# EAGLE board ORAO2007 (EAGLE 9.6.2)
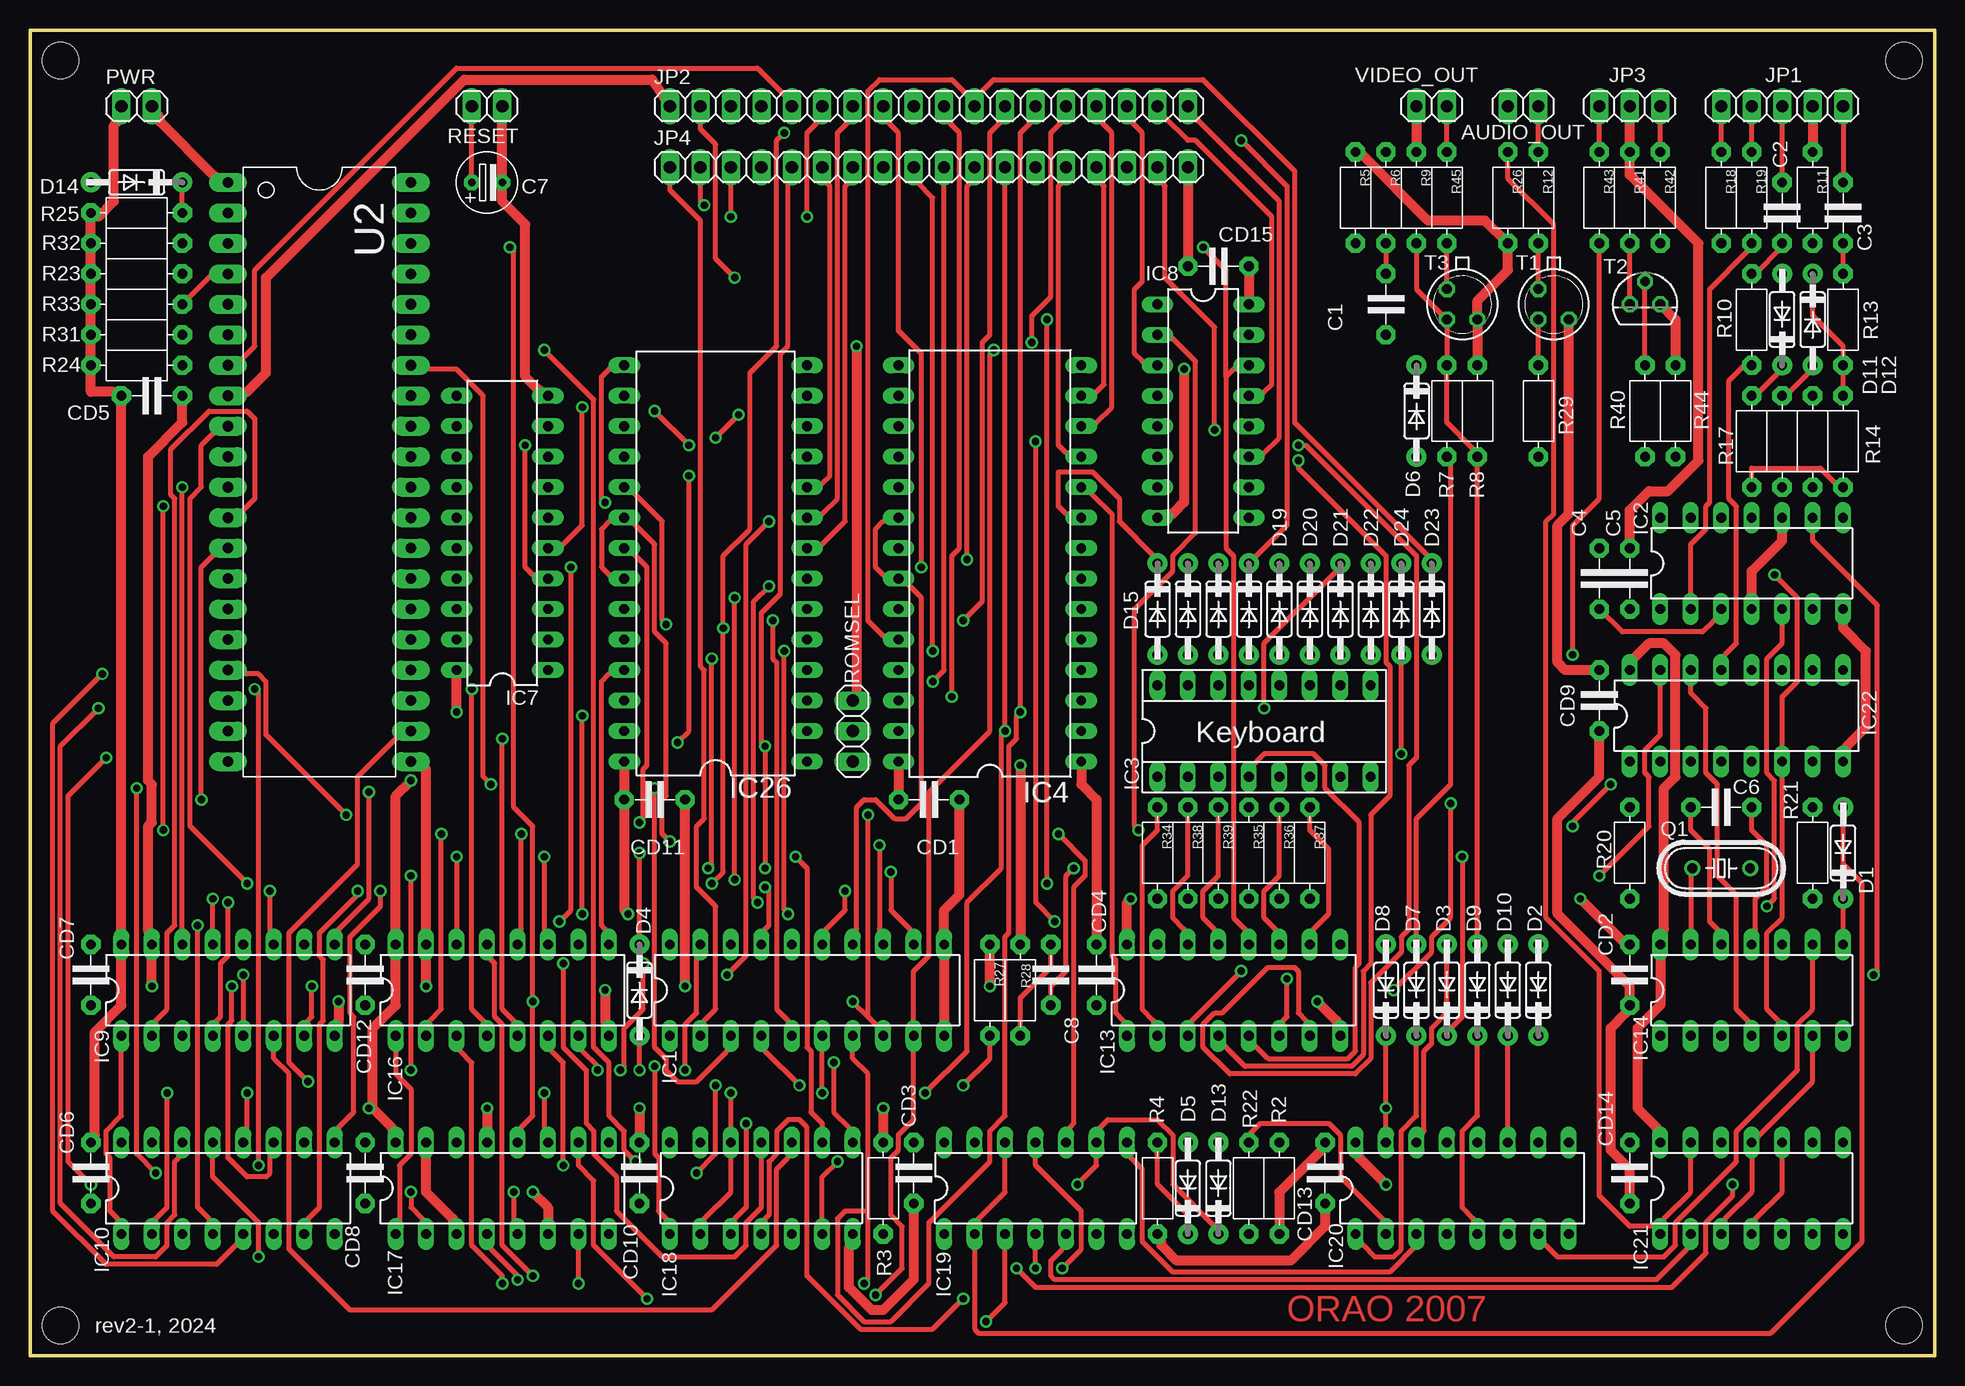
[diagram p1: board, top side]
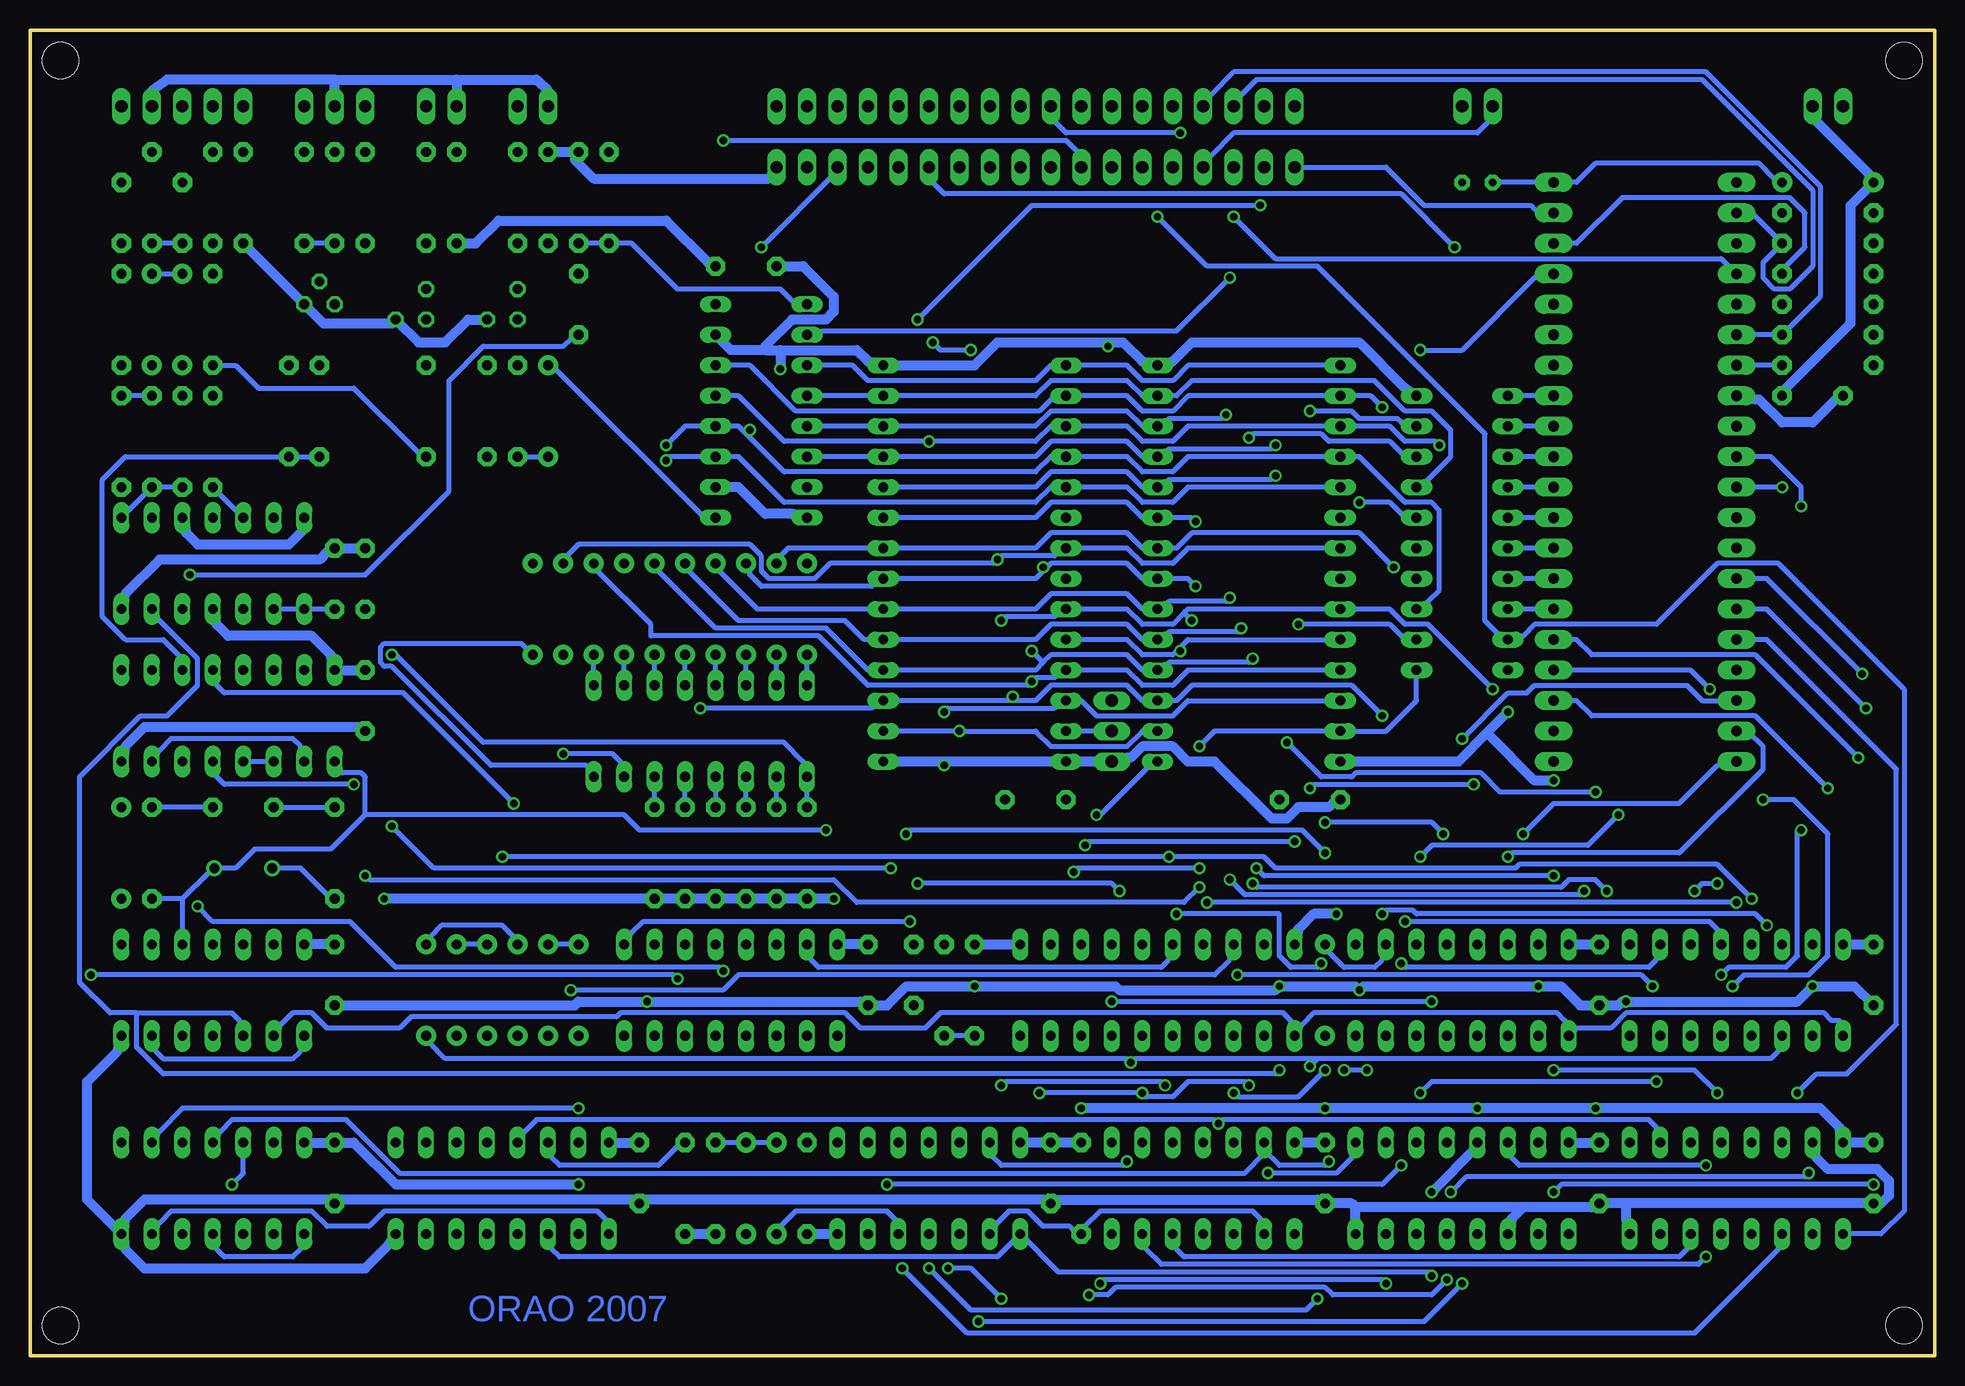
[diagram p2: board, bottom side, seen from below]

Size 158.75 x 110.49 mm. Coordinates in mm from the lower left corner, seen from the top.
Outline: 0,0 158.75,0 158.75,110.49 0,110.49 0,0
Copper layers (1*16): Top 0.035mm / dielectric 1.5mm / Bottom 0.035mm
Design rules "default": minimum track width 16mil, minimum drill 24mil, track to track 8mil, track to pad 8mil, pad to pad 8mil, via to via 8mil, smd to smd 8mil, copper to edge 40mil, drill to drill 8mil, minimum pad ring 10mil, minimum via ring 8mil, stop-mask expansion 4mil, vias tented up to drill 0mil, thermal gap 10mil
Net classes: 0 default: width 0.406 mm, clearance 0.203 mm; 1 gnd: width 0.813 mm, clearance 0.203 mm; 2 vcc: width 0.813 mm, clearance 0.203 mm
Holes 3.05 mm at 2.54,107.95 156.21,107.95 156.21,2.54 2.54,2.54

## Footprints (pad centres in the part's own frame; a part is rotated, then mirrored left to right if it is on the bottom)
1X02 = drill 1.016 long: 1 -1.27,0; 2 1.27,0
C-5 = drill 0.813 pad 1.6 octagon: 1 -2.54,0; 2 2.54,0
ES-2,5L = drill 0.61 pad 1.27 octagon: 1 0,0; 2 2.54,0
DO35-10 = drill 0.813 pad 1.676: A 3.81,0; C -3.81,0
DIL20 = drill 0.813 long: 1 -11.43,-3.81; 2 -8.89,-3.81; 3 -6.35,-3.81; 4 -3.81,-3.81; 5 -1.27,-3.81; 6 1.27,-3.81; 7 3.81,-3.81; 8 6.35,-3.81; 9 8.89,-3.81; 10 11.43,-3.81; 11 11.43,3.81; 12 8.89,3.81; 13 6.35,3.81; 14 3.81,3.81; 15 1.27,3.81; 16 -1.27,3.81; 17 -3.81,3.81; 18 -6.35,3.81; 19 -8.89,3.81; 20 -11.43,3.81
DIL14 = drill 0.813 long: 1 -7.62,-3.81; 2 -5.08,-3.81; 3 -2.54,-3.81; 4 0,-3.81; 5 2.54,-3.81; 6 5.08,-3.81; 7 7.62,-3.81; 8 7.62,3.81; 9 5.08,3.81; 10 2.54,3.81; 11 0,3.81; 12 -2.54,3.81; 13 -5.08,3.81; 14 -7.62,3.81
SOCKED-16 = drill 0.813 long: 1 -8.89,-3.81; 2 -6.35,-3.81; 3 -3.81,-3.81; 4 -1.27,-3.81; 5 1.27,-3.81; 6 3.81,-3.81; 7 6.35,-3.81; 8 8.89,-3.81; 9 8.89,3.81; 10 6.35,3.81; 11 3.81,3.81; 12 1.27,3.81; 13 -1.27,3.81; 14 -3.81,3.81; 15 -6.35,3.81; 16 -8.89,3.81
DIL28 = drill 0.813 long: 1 -16.51,-7.62; 2 -13.97,-7.62; 3 -11.43,-7.62; 4 -8.89,-7.62; 5 -6.35,-7.62; 6 -3.81,-7.62; 7 -1.27,-7.62; 8 1.27,-7.62; 9 3.81,-7.62; 10 6.35,-7.62; 11 8.89,-7.62; 12 11.43,-7.62; 13 13.97,-7.62; 14 16.51,-7.62; 15 16.51,7.62; 16 13.97,7.62; 17 11.43,7.62; 18 8.89,7.62; 19 6.35,7.62; 20 3.81,7.62; 21 1.27,7.62; 22 -1.27,7.62; 23 -3.81,7.62; 24 -6.35,7.62; 25 -8.89,7.62; 26 -11.43,7.62; 27 -13.97,7.62; 28 -16.51,7.62
DIL16 = drill 0.813 long: 1 -8.89,-3.81; 2 -6.35,-3.81; 3 -3.81,-3.81; 4 -1.27,-3.81; 5 1.27,-3.81; 6 3.81,-3.81; 7 6.35,-3.81; 8 8.89,-3.81; 9 8.89,3.81; 10 6.35,3.81; 11 3.81,3.81; 12 1.27,3.81; 13 -1.27,3.81; 14 -3.81,3.81; 15 -6.35,3.81; 16 -8.89,3.81
DIL28-6 = drill 0.813 long: 1 -16.51,-7.62; 2 -13.97,-7.62; 3 -11.43,-7.62; 4 -8.89,-7.62; 5 -6.35,-7.62; 6 -3.81,-7.62; 7 -1.27,-7.62; 8 1.27,-7.62; 9 3.81,-7.62; 10 6.35,-7.62; 11 8.89,-7.62; 12 11.43,-7.62; 13 13.97,-7.62; 14 16.51,-7.62; 15 16.51,7.62; 16 13.97,7.62; 17 11.43,7.62; 18 8.89,7.62; 19 6.35,7.62; 20 3.81,7.62; 21 1.27,7.62; 22 -1.27,7.62; 23 -3.81,7.62; 24 -6.35,7.62; 25 -8.89,7.62; 26 -11.43,7.62; 27 -13.97,7.62; 28 -16.51,7.62
1X05 = drill 1.016 long: 1 -5.08,0; 2 -2.54,0; 3 0,0; 4 2.54,0; 5 5.08,0
1X18 = drill 1.016 long: 1 -21.59,0; 2 -19.05,0; 3 -16.51,0; 4 -13.97,0; 5 -11.43,0; 6 -8.89,0; 7 -6.35,0; 8 -3.81,0; 9 -1.27,0; 10 1.27,0; 11 3.81,0; 12 6.35,0; 13 8.89,0; 14 11.43,0; 15 13.97,0; 16 16.51,0; 17 19.05,0; 18 21.59,0
1X03 = drill 1.016 long: 1 -2.54,0; 2 0,0; 3 2.54,0
HC49/S = drill 0.813: 1 -2.413,0; 2 2.413,0
R-7,5 = drill 0.813 pad 1.6 octagon: 1 -3.81,0; 2 3.81,0
TO18 = drill 0.813 octagon: 1 -1.27,-1.27; 2 1.27,-1.27; 3 1.27,1.27
TO92 = drill 0.813 octagon: 1 1.27,0; 2 0,1.905; 3 -1.27,0
DIP-40 = drill 0.889 pad 1.6 long: 1 -22.86,-7.62; 2 -20.32,-7.62; 3 -17.78,-7.62; 4 -15.24,-7.62; 5 -12.7,-7.62; 6 -10.16,-7.62; 7 -7.62,-7.62; 8 -5.08,-7.62; 9 -2.54,-7.62; 10 0,-7.62; 11 2.54,-7.62; 12 5.08,-7.62; 13 7.62,-7.62; 14 10.16,-7.62; 15 12.7,-7.62; 16 15.24,-7.62; 17 17.78,-7.62; 18 20.32,-7.62; 19 22.86,-7.62; 20 25.4,-7.62; 21 25.4,7.62; 22 22.86,7.62; 23 20.32,7.62; 24 17.78,7.62; 25 15.24,7.62; 26 12.7,7.62; 27 10.16,7.62; 28 7.62,7.62; 29 5.08,7.62; 30 2.54,7.62; 31 0,7.62; 32 -2.54,7.62; 33 -5.08,7.62; 34 -7.62,7.62; 35 -10.16,7.62; 36 -12.7,7.62; 37 -15.24,7.62; 38 -17.78,7.62; 39 -20.32,7.62; 40 -22.86,7.62

## Placement (x,y rotation side)
AUDIO_OUT  [1X02]  124.46,104.14 180 top
C1  100p  [C-5]  113.03,87.63 90 top
C2  [C-5]  146.05,95.25 270 top
C3  100n  [C-5]  151.13,95.25 90 top
C4  22n  [C-5]  130.81,64.77 90 top
C5  10n  [C-5]  133.35,64.77 90 top
C6  1n  [C-5]  140.97,45.72 0 top
C7  10u  [ES-2,5L]  36.83,97.79 0 top
C8  100p  [C-5]  85.09,31.75 270 top
CD1  100n  [C-5]  74.93,46.35 180 top
CD2  100n  [C-5]  133.35,31.75 90 top
CD3  100n  [C-5]  73.66,15.24 90 top
CD4  100n  [C-5]  88.9,31.75 90 top
CD5  100n  [C-5]  10.16,80.01 180 top
CD6  100n  [C-5]  5.08,15.24 90 top
CD7  100n  [C-5]  5.08,31.75 90 top
CD8  100n  [C-5]  27.94,15.24 90 top
CD9  100n  [C-5]  130.81,54.61 90 top
CD10  100n  [C-5]  50.8,15.24 90 top
CD11  100n  [C-5]  52.07,46.35 180 top
CD12  100n  [C-5]  27.94,31.75 90 top
CD13  100n  [C-5]  107.95,15.24 90 top
CD14  100n  [C-5]  133.35,15.24 90 top
CD15  100n  [C-5]  99.06,90.81 0 top
D1  1N4148  [DO35-10]  151.13,41.91 90 top
D2  1N4148  [DO35-10]  125.73,30.48 90 top
D3  1N4148  [DO35-10]  118.11,30.48 90 top
D4  1N4148  [DO35-10]  50.8,30.48 270 top
D5  1N4148  [DO35-10]  96.52,13.97 90 top
D6  1N4148  [DO35-10]  115.57,78.74 270 top
D7  1N4148  [DO35-10]  115.57,30.48 90 top
D8  1N4148  [DO35-10]  113.03,30.48 90 top
D9  1N4148  [DO35-10]  120.65,30.48 90 top
D10  1N4148  [DO35-10]  123.19,30.48 90 top
D11  1N4148  [DO35-10]  146.05,86.36 90 top
D12  1N4148  [DO35-10]  148.59,86.36 270 top
D13  1N4148  [DO35-10]  99.06,13.97 90 top
D14  1N4148  [DO35-10]  8.89,97.79 180 top
D15  1N4148  [DO35-10]  93.98,62.23 270 top
D16  1N4148  [DO35-10]  96.52,62.23 270 top
D17  1N4148  [DO35-10]  99.06,62.23 270 top
D18  1N4148  [DO35-10]  101.6,62.23 270 top
D19  1N4148  [DO35-10]  104.14,62.23 270 top
D20  1N4148  [DO35-10]  106.68,62.23 270 top
D21  1N4148  [DO35-10]  109.22,62.23 270 top
D22  1N4148  [DO35-10]  111.76,62.23 270 top
D23  1N4148  [DO35-10]  116.84,62.23 270 top
D24  1N4148  [DO35-10]  114.3,62.23 270 top
IC1  GAL16V8  [DIL20]  64.77,30.48 0 top
IC2  NE556N  [DIL14]  143.51,66.04 0 top
IC3  [SOCKED-16]  102.87,52.07 0 top
IC4  27256  [DIL28]  80.01,66.04 90 top
IC7  74AC245N  [DIL20]  39.37,68.58 90 top
IC8  74HC165N  [DIL16]  97.79,78.74 270 top
IC9  74AC257N  [DIL16]  16.51,30.48 0 top
IC10  74AC257N  [DIL16]  16.51,13.97 0 top
IC13  74AC257N  [DIL16]  100.33,30.48 0 top
IC14  74AC04N  [DIL14]  143.51,30.48 0 top
IC16  74AC257N  [DIL16]  39.37,30.48 0 top
IC17  74AC257N  [DIL16]  39.37,13.97 0 top
IC18  74AC393N  [DIL14]  60.96,13.97 0 top
IC19  74AC393N  [DIL14]  83.82,13.97 0 top
IC20  74AC139N  [DIL16]  119.38,13.97 0 top
IC21  74AC74N  [DIL14]  143.51,13.97 0 top
IC22  74AC390N  [DIL16]  142.24,53.34 0 top
IC26  62256  [DIL28-6]  57.15,66.04 90 top
JP1  [1X05]  146.05,104.14 180 top
JP2  [1X18]  74.93,104.14 0 top
JP3  [1X03]  133.35,104.14 180 top
JP4  [1X18]  74.93,99.06 0 top
PWR  [1X02]  8.89,104.14 0 top
Q1  8MHz  [HC49/S]  140.97,40.64 0 top
R2  10K  [R-7,5]  104.14,13.97 90 top
R3  10K  [R-7,5]  71.12,13.97 270 top
R4  470  [R-7,5]  93.98,13.97 90 top
R5  1K  [R-7,5]  110.49,96.52 90 top
R6  1K5  [R-7,5]  113.03,96.52 270 top
R7  330  [R-7,5]  118.11,78.74 90 top
R8  1K  [R-7,5]  120.65,78.74 90 top
R9  4K7  [R-7,5]  115.57,96.52 90 top
R10  47K  [R-7,5]  143.51,86.36 90 top
R11  470  [R-7,5]  148.59,96.52 270 top
R12  47  [R-7,5]  125.73,96.52 90 top
R13  10K  [R-7,5]  151.13,86.36 270 top
R14  22K  [R-7,5]  151.13,76.2 90 top
R15  22K  [R-7,5]  148.59,76.2 270 top
R16  47K  [R-7,5]  146.05,76.2 90 top
R17  47K  [R-7,5]  143.51,76.2 270 top
R18  100  [R-7,5]  140.97,96.52 90 top
R19  100  [R-7,5]  143.51,96.52 90 top
R20  330  [R-7,5]  133.35,41.91 270 top
R21  330  [R-7,5]  148.59,41.91 270 top
R22  10K  [R-7,5]  101.6,13.97 270 top
R23  10K  [R-7,5]  8.89,90.17 0 top
R24  10K  [R-7,5]  8.89,82.55 0 top
R25  10K  [R-7,5]  8.89,95.25 180 top
R26  10K  [R-7,5]  123.19,96.52 90 top
R27  1K  [R-7,5]  82.55,30.48 90 top
R28  1K  [R-7,5]  80.01,30.48 270 top
R29  1K  [R-7,5]  125.73,78.74 270 top
R31  10K  [R-7,5]  8.89,85.09 0 top
R32  10K  [R-7,5]  8.89,92.71 0 top
R33  10K  [R-7,5]  8.89,87.63 0 top
R34  10K  [R-7,5]  93.98,41.91 90 top
R35  10K  [R-7,5]  101.6,41.91 90 top
R36  10K  [R-7,5]  104.14,41.91 90 top
R37  10K  [R-7,5]  106.68,41.91 90 top
R38  10K  [R-7,5]  96.52,41.91 90 top
R39  10K  [R-7,5]  99.06,41.91 90 top
R40  10K  [R-7,5]  134.62,78.74 90 top
R41  10K  [R-7,5]  133.35,96.52 90 top
R42  470  [R-7,5]  135.89,96.52 270 top
R43  1K2  [R-7,5]  130.81,96.52 90 top
R44  4K7  [R-7,5]  137.16,78.74 90 top
R45  47  [R-7,5]  118.11,96.52 90 top
RESET  [1X02]  38.1,104.14 180 top
ROMSEL  [1X03]  68.58,52.07 90 top
T1  BC108C  [TO18]  127,87.63 270 top
T2  BC214  [TO92]  134.62,87.63 0 top
T3  BC108C  [TO18]  119.38,87.63 270 top
U2  6502  [DIP-40]  24.13,74.93 270 top
VIDEO_OUT  [1X02]  116.84,104.14 180 top

## Tracks (layer width: path | path; a pad name or v marks a point on that pad's centre or on a via)
1B9  (via drill 0.61)
  Top 0.406: v52.07,24.13 52.07,16.83 52.39,16.51 52.39,12.06 53.02,11.43 IC18.1 | v66.99,24.45 66.99,20.32 68.26,19.05 IC18.8
  Bottom 0.406: 51.44,24.77 v52.07,24.13 | 51.44,24.77 13.65,24.77 13.02,25.4 IC9.3 | 51.44,24.77 66.67,24.77 v66.99,24.45 67.31,24.77 124.14,24.77 125.41,26.04 D2.C
1B10  (via drill 0.61)
  Top 0.406: v86.04,7.3 87.63,8.89 87.63,12.06 83.82,15.88 IC19.11
  Bottom 0.406: v86.04,7.3 80.64,1.91 20,1.91 13.02,8.89 IC10.3
1B16  (via drill 0.61)
  Top 0.406: v39.37,6.03 39.37,6.67 36.83,9.21 36.83,24.45 35.88,25.4 IC16.3 | v79.69,2.86 81.28,4.45 IC19.3
  Bottom 0.406: v39.37,6.03 42.55,2.86 v79.69,2.86
2B10
  Bottom 0.406: IC10.6 20.64,8.89 21.27,8.26 62.55,8.26 63.18,8.89 IC18.5
2B16  (via drill 0.61)
  Top 0.406: v44.45,15.88 44.45,24.45 43.5,25.4 IC16.6 | v87.31,14.29 88.9,15.88 IC19.9 88.9,18.73 89.85,19.68 93.98,19.68 95.25,18.41 95.25,14.29 98.74,10.79 D13.C
  Bottom 0.406: v44.45,15.88 46.04,14.29 v87.31,14.29
2MHZ  (via drill 0.61)
  Top 0.406: v131.76,47.62 128.59,44.45 v128.59,44.13 | v87,40.64 86.36,40.01 86.36,32.07 85.09,30.8 C8.2
  Bottom 0.406: v131.76,47.62 142.56,47.62 143.51,48.58 IC22.5 | v128.59,44.13 125.09,40.64 v87,40.64
2MHZ'  (via drill 0.61)
  Top 0.406: v64.14,22.54 61.28,25.4 IC1.4 | v77.79,22.54 80.01,24.77 R28.2 | C8.1 85.09,32.38 82.55,29.84 R27.1
  Bottom 0.406: v64.14,22.54 64.45,22.86 77.47,22.86 v77.79,22.54 | R28.2 R27.1
2Y0
  Bottom 0.406: IC1.16 63.82,33.02 64.45,32.38 93.03,32.38 93.66,33.02 IC13.15
2Y1  (via drill 0.61)
  Top 0.406: v61.28,39.05 61.59,38.73 61.59,35.88 61.28,35.56 IC1.17 | v130.81,40.01 134.94,44.13 134.94,48.26 134.62,48.58 134.62,50.48 135.89,51.75 IC22.15
  Bottom 0.406: v61.28,39.05 62.55,37.78 89.85,37.78 91.76,39.69 130.49,39.69 v130.81,40.01
2Y2  (via drill 0.61)
  Top 0.406: v113.67,30.48 116.84,33.66 116.84,34.92 118.43,36.51 v118.43,46.04
  Bottom 0.406: v113.67,30.48 100.97,30.48 99.69,31.75 60.01,31.75 58.74,33.02 IC1.18 | v118.43,46.04 127.64,55.24 142.56,55.24 143.19,55.88 IC22.12
2Y3  (via drill 0.61)
  Top 0.406: v54.61,23.81 54.61,27.62 55.56,28.57 55.56,33.02 IC1.19
  Bottom 0.406: v54.61,23.81 54.93,23.5 147.64,23.5 149.86,25.72 149.86,28.57 | 149.86,28.57 141.92,28.57 141.29,27.94 IC14.3 | 149.86,28.57 152.08,28.57 154.62,31.11 154.62,48.26 149.54,53.34 147.32,53.34 144.78,55.88 144.78,58.1 147.96,61.28 IC2.6
3B9  (via drill 0.61)
  Top 0.406: v44.45,32.7 44.45,25.72 46.35,23.81 46.35,19.37 46.99,18.73 46.99,16.83 48.9,14.92 48.9,12.06 52.7,8.26 58.74,8.26 59.69,9.21 59.69,11.11 60.96,12.38 IC18.11
  Bottom 0.406: v44.45,32.7 44.13,32.38 23.81,32.38 23.18,33.02 IC9.10
3B10  (via drill 0.61)
  Top 0.406: v59.69,19.37 59.69,12.38 58.74,11.43 IC18.3
  Bottom 0.406: IC10.10 23.18,19.05 23.81,19.68 59.37,19.68 v59.69,19.37 60.01,19.68 116.52,19.68 117.47,18.73 IC20.13
3B16  (via drill 0.61)
  Top 0.406: v85.72,43.5 87.95,41.27 87.95,40.01 87,39.05 87,19.37 86.68,19.05 IC19.10 | D4.C v50.8,41.91
  Bottom 0.406: v85.72,43.5 85.41,43.81 52.7,43.81 v50.8,41.91 | IC16.10 46.04,33.02 46.67,32.38 49.21,32.38 50.48,33.66 D4.C
3B17  (via drill 0.61)
  Top 0.406: v51.44,4.76 46.99,9.21 46.99,14.61 45.72,15.88 IC17.10 | v83.82,7.3 IC19.4
  Bottom 0.406: v83.82,7.3 80.33,3.81 52.39,3.81 v51.44,4.76
4B9  (via drill 0.61)
  Top 0.406: v63.82,41.59 64.77,40.64 64.77,25.72 65.09,25.4 65.09,20.32 66.04,19.37 IC18.9 | IC9.13 v15.24,38.1 | v119.38,41.59 119.38,28.26 118.43,27.3 D3.C
  Bottom 0.406: v15.24,38.1 18.1,40.96 34.61,40.96 34.92,40.64 54.93,40.64 55.88,41.59 v63.82,41.59 v119.38,41.59
4B10  (via drill 0.61)
  Top 0.406: IC10.13 15.24,14.92 19.05,11.11 v19.05,8.26 | v67.31,16.19 66.04,14.92 IC18.6
  Bottom 0.406: v19.05,8.26 19.68,7.62 64.45,7.62 65.72,8.89 IC18.6 | v67.31,16.19 67.63,15.88 77.79,15.88 78.42,16.51 IC19.13
4B16  (via drill 0.61)
  Top 0.406: v41.91,6.67 39.37,9.21 39.37,27.62 38.73,28.26 38.73,32.7 38.42,33.02 IC16.13 | IC20.3 115.57,9.21 113.35,6.99 95.25,6.99 92.71,9.53 92.71,15.56 91.76,16.51 IC19.8
  Bottom 0.406: IC20.3 115.25,8.89 114.62,8.26 78.11,8.26 IC19.1 73.03,6.99 42.23,6.99 v41.91,6.67
8MHZ  (via drill 0.61)
  Top 0.406: v58.74,89.85 57.15,91.44 57.15,100.97 55.88,102.23 JP2.2 | v92.39,43.81 92.08,44.13 92.08,62.23 95.25,65.41 95.25,66.67 97.16,68.58 97.16,82.87 95.25,84.77 IC8.2
  Bottom 0.406: 146.05,38.1 143.83,40.32 Q1.2 141.6,40.64 140.02,42.23 133.67,42.23 130.81,45.09 | 146.05,38.1 R21.2 | 130.81,45.09 130.81,48.26 131.13,48.58 132.72,48.58 IC22.1 | 146.05,38.1 IC14.10 | v58.74,89.85 63.18,85.41 92.71,85.41 IC8.2 | 130.81,45.09 109.22,45.09 107.95,43.81 v92.39,43.81
!RAMCS  (via drill 0.61)
  Top 0.406: IC26.22 48.26,65.09 47.62,65.72 47.62,68.9 48.26,69.53 IC26.20 50.48,69.22 52.07,67.63 52.07,60.33 53.02,59.37 53.02,46.67 52.7,46.35 52.7,43.5 v53.34,42.86 | v70.8,42.55 70.8,35.56 IC1.13
  Bottom 0.406: v70.8,42.55 70.48,42.86 v53.34,42.86
!ROMCS
  Top 0.406: IC1.14 68.9,35.56 68.9,45.72 69.53,46.35 70.48,46.35 72.07,44.77 73.03,44.77 74.3,46.04 74.3,63.18 73.34,64.14 IC4.22 71.12,65.09 70.48,65.72 70.48,68.9 71.12,69.53 IC4.20
A0  (via drill 0.61)
  Top 0.406: v28.26,46.99 28.26,38.1 25.72,35.56 IC9.9 | v53.98,51.12 54.93,52.07 v54.93,73.34 | IC13.1 91.12,27.94 90.49,28.57 90.49,33.02 90.17,33.34 90.17,70.17 88.58,71.75 IC4.10 | JP4.6 66.36,97.79 66.67,97.47 66.67,73.34 66.04,72.71 IC26.10
  Bottom 0.406: IC4.10 74.93,72.39 73.66,73.66 67.31,73.66 66.04,72.39 IC26.10 63.82,73.03 55.24,73.03 v54.93,73.34 | v28.26,46.99 36.2,46.99 37.78,48.58 48.26,48.58 48.58,48.26 51.12,48.26 v53.98,51.12
A0'  (via drill 0.61)
  Top 0.406: v20,38.73 20,35.56 IC9.11 | v18.1,39.37 13.34,44.13 13.34,71.44 14.29,72.39 14.29,75.88 15.24,76.83 U2.9
  Bottom 0.406: v20,38.73 19.37,39.37 v18.1,39.37
A1  (via drill 0.61)
  Top 0.406: v23.5,30.8 23.5,28.26 23.18,27.94 IC9.7 | v58.1,31.75 59.69,33.34 59.69,67.63 v61.59,69.53 | JP2.7 68.26,102.87 67.31,101.92 67.31,71.44 66.04,70.17 IC26.9 | D15.C 93.66,66.67 90.81,69.53 90.81,71.44 88.58,73.66 85.72,73.66 85.72,70.8 86.36,70.17 IC4.9
  Bottom 0.406: IC4.9 74.93,69.85 73.66,71.12 67.31,71.12 66.04,69.85 IC26.9 61.91,69.85 v61.59,69.53 | v23.5,30.8 24.45,31.75 v58.1,31.75
A1'  (via drill 0.61)
  Top 0.406: v11.11,43.81 v11.11,70.8 | v17.78,31.75 IC9.5
  Bottom 0.406: v17.78,31.75 17.14,32.38 12.38,32.38 11.43,33.34 11.43,43.81 v11.11,43.81 | v11.11,70.8 11.11,72.39 13.65,74.93 U2.10
A2  (via drill 0.61)
  Top 0.406: v44.13,36.2 45.09,37.15 v45.09,65.72 | JP4.7 68.26,97.79 67.94,97.47 67.94,69.53 66.04,67.63 IC26.8
  Bottom 0.406: v44.13,36.2 18.73,36.2 18.1,35.56 IC9.12 | v45.09,65.72 47.94,68.58 61.91,68.58 63.18,67.31 IC26.8 66.04,67.31 67.31,68.58 73.66,68.58 74.93,67.31 IC4.8 95.57,67.31 96.2,66.67 D16.C
A2'  (via drill 0.61)
  Top 0.406: IC9.14 v12.7,72.39
  Bottom 0.406: v12.7,72.39 U2.11
A3  (via drill 0.61)
  Top 0.406: v16.51,37.78 16.51,33.34 15.88,32.7 15.88,28.26 15.56,27.94 IC9.4 | v60.64,37.78 60.33,38.1 60.33,62.87 v61.59,64.14 | v74.3,65.72 74.3,83.5 72.39,85.41 72.39,101.92 71.44,102.87 JP2.8
  Bottom 0.406: 73.98,65.72 73.66,66.04 67.31,66.04 66.04,64.77 IC26.7 62.23,64.77 v61.59,64.14 | 73.98,65.72 74.93,64.77 IC4.7 88.58,64.14 97.79,64.14 98.74,65.09 98.74,65.41 D17.C | v16.51,37.78 v60.64,37.78 | 73.98,65.72 v74.3,65.72
A3'
  Top 0.406: IC9.2 10.48,27.94 11.43,28.89 11.43,35.24 12.06,35.88 12.06,71.44 11.75,71.75 11.75,75.56 14.92,78.74 18.1,78.74 18.73,78.11 18.73,71.44 17.78,70.48 U2.12
A4  (via drill 0.61)
  Top 0.406: v100.97,101.28 104.78,97.47 104.78,69.22 D18.C | v29.21,38.73 29.21,37.47 26.67,34.92 26.67,28.57 26.99,28.26 26.99,20.32 25.72,19.05 IC10.9 | v58.74,39.69 v58.74,63.18
  Bottom 0.406: v100.97,101.28 72.39,101.28 71.44,100.33 JP4.8 | v29.21,38.73 29.53,38.42 57.47,38.42 v58.74,39.69 | v58.74,63.18 59.05,62.87 63.82,62.87 IC26.6 66.04,62.23 67.31,63.5 73.66,63.5 74.93,62.23 IC4.6 98.11,62.23 101.28,65.41 D18.C
A4'  (via drill 0.61)
  Top 0.406: v16.83,30.8 16.83,27.94 16.51,27.62 16.51,16.51 18.1,14.92 19.68,14.92 20,15.24 20,16.51 IC10.11 | v14.29,46.35 14.29,65.72 15.24,66.67 U2.13
  Bottom 0.406: v16.83,30.8 15.88,31.75 10.48,31.75 8.89,33.34 8.89,43.5 11.75,46.35 v14.29,46.35
A5  (via drill 0.61)
  Top 0.406: v27.3,38.73 27.3,38.42 24.13,35.24 24.13,33.34 24.45,33.02 24.45,27.94 24.13,27.62 24.13,12.38 23.18,11.43 IC10.7 | v56.83,39.37 57.78,40.32 v57.78,60.64 57.78,66.67 60.01,68.9 60.01,81.92 62.23,84.14 62.23,101.28 v62.87,101.92
  Bottom 0.406: v27.3,38.73 28.26,39.69 30.48,39.69 31.11,39.05 56.52,39.05 v56.83,39.37 | v57.78,60.64 58.1,60.33 63.82,60.33 IC26.5 66.04,59.69 67.31,60.96 73.66,60.96 74.93,59.69 IC4.5 89.22,59.69 90.81,61.28 99.69,61.28 103.82,65.41 D19.C | v62.87,101.92 72.39,101.92 73.34,102.87 JP2.9
A5'  (via drill 0.61)
  Top 0.406: v6.03,56.83 1.91,52.7 1.91,12.06 6.35,7.62 15.56,7.62 17.14,9.21 IC10.5
  Bottom 0.406: v6.03,56.83 13.97,64.77 U2.14
A6  (via drill 0.61)
  Top 0.406: v18.1,21.91 18.1,19.05 IC10.12 | v31.75,23.81 v31.75,40.01 | v56.52,40.64 56.83,40.96 v56.83,58.1 | v75.25,58.74 75.25,96.52 73.98,97.79 JP4.9
  Bottom 0.406: 74.3,57.78 73.66,58.42 67.31,58.42 66.04,57.15 IC26.4 63.82,57.78 57.15,57.78 v56.83,58.1 | 74.3,57.78 74.93,57.15 IC4.4 88.9,57.15 92.39,60.64 101.6,60.64 106.36,65.41 D20.C | v18.1,21.91 20,23.81 v31.75,23.81 | v31.75,40.01 55.88,40.01 v56.52,40.64 | 74.3,57.78 v75.25,58.74
A6'  (via drill 0.61)
  Top 0.406: v5.71,53.98 2.54,50.8 2.54,12.7 6.99,8.26 10.48,8.26 11.43,9.21 11.43,11.11 12.06,11.75 12.06,16.19 12.38,16.51 IC10.14
  Bottom 0.406: v5.71,53.98 13.97,62.23 U2.15
A7  (via drill 0.61)
  Top 0.406: v13.97,35.88 13.97,12.38 14.92,11.43 IC10.4 | v46.04,36.83 v46.04,53.34 | v76.83,54.93 76.83,66.67 77.47,67.31 77.47,101.92 76.52,102.87 JP2.10 | v102.87,53.98 102.87,59.37 108.9,65.41 D21.C
  Bottom 0.406: 76.83,54.61 74.93,54.61 73.66,55.88 67.31,55.88 66.04,54.61 IC26.3 63.18,54.61 61.91,55.88 48.58,55.88 v46.04,53.34 | 76.83,54.61 IC4.3 88.58,53.98 v102.87,53.98 | v13.97,35.88 14.92,36.83 43.18,36.83 43.5,37.15 45.72,37.15 v46.04,36.83 | 76.83,54.61 v76.83,54.93
A7'  (via drill 0.61)
  Top 0.406: v11.43,21.91 11.43,12.38 10.48,11.43 IC10.2
  Bottom 0.406: v11.43,21.91 9.84,23.5 7.3,23.5 3.17,27.62 3.17,48.9 13.97,59.69 U2.16
A8  (via drill 0.61)
  Top 0.406: IC16.9 47.94,35.56 47.62,35.88 47.62,56.2 48.26,56.83 IC26.25 | v75.25,56.2 76.2,57.15 JP4.10
  Bottom 0.406: IC26.25 62.23,57.15 63.5,55.88 66.04,55.88 67.31,57.15 IC4.25 73.34,56.52 74.93,56.52 v75.25,56.2 75.56,55.88 88.9,55.88 93.03,60.01 107,60.01 107,60.96 111.44,65.41 D22.C
A8'  (via drill 0.61)
  Top 0.406: v42.86,41.59 42.86,35.56 IC16.11 | v26.35,45.09 19.68,51.75 19.68,56.2 19.05,56.83 18.1,56.83 U2.17
  Bottom 0.406: v42.86,41.59 41.91,42.55 28.89,42.55 v26.35,45.09
A9  (via drill 0.61)
  Top 0.406: v47.31,23.81 47.31,24.13 46.04,25.4 IC16.7 | v49.21,23.81 49.53,24.13 49.53,27.3 51.12,28.89 v51.12,32.7 | v63.18,36.83 62.87,37.15 v62.87,58.74 | IC4.24 71.12,60.01 69.85,61.28 69.85,105.41 70.8,106.36 76.83,106.36 78.11,105.09 JP2.11 78.74,104.78 80.33,106.36 97.79,106.36 105.41,98.74 105.41,77.79 116.52,66.67 D23.C
  Bottom 0.406: IC26.24 62.23,59.69 62.87,59.05 | 62.87,59.05 63.5,58.42 66.04,58.42 67.31,59.69 IC4.24 | v47.31,23.81 v49.21,23.81 | v51.12,32.7 51.44,32.38 53.66,32.38 54.61,33.34 54.61,36.83 v63.18,36.83 | v62.87,58.74 62.87,59.05
A9'  (via drill 0.61)
  Top 0.406: v39.37,51.44 39.37,28.89 40.32,27.94 IC16.5
  Bottom 0.406: v39.37,51.44 35.56,55.24 33.97,55.24 33.34,55.88 20.64,55.88 19.37,54.61 U2.18
A10  (via drill 0.61)
  Top 0.406: v40.96,43.5 40.96,35.56 IC16.12 | v50.8,44.45 51.12,44.77 51.12,48.9 51.44,49.21 51.44,65.72 50.48,66.67 IC26.21 | v78.11,66.36 78.11,97.47 78.42,97.79 JP4.11
  Bottom 0.406: IC26.21 62.23,67.31 63.5,66.04 66.04,66.04 67.31,67.31 IC4.21 73.34,66.67 77.79,66.67 v78.11,66.36 78.42,66.04 92.08,66.04 93.34,64.77 97.16,64.77 97.79,65.41 97.79,66.67 98.74,67.63 113.03,67.63 113.98,66.67 D24.C | v40.96,43.5 41.91,44.45 v50.8,44.45
A10'  (via drill 0.61)
  Top 0.406: v35.56,41.59 IC16.14
  Bottom 0.406: v35.56,41.59 35.24,41.91 21.27,41.91 14.29,48.9 14.29,50.8 15.56,52.07 U2.19
A11  (via drill 0.61)
  Top 0.406: v36.83,55.56 36.83,28.89 37.78,27.94 IC16.4 | v61.91,61.28 61.91,58.1 62.23,57.78 62.23,28.89 63.18,27.94 IC1.5 | v77.79,61.28 79.38,62.87 79.38,84.45 80.01,85.09 80.01,101.92 80.96,102.87 JP2.12
  Bottom 0.406: 62.55,61.91 62.23,62.23 IC26.23 45.4,62.23 44.13,60.96 42.23,60.96 v36.83,55.56 | 62.55,61.91 63.5,60.96 66.04,60.96 67.31,62.23 IC4.23 73.34,61.59 77.47,61.59 v77.79,61.28 | 62.55,61.91 v61.91,61.28
A11'  (via drill 0.61)
  Top 0.406: v34.29,43.5 34.29,28.89 33.34,27.94 IC16.2
  Bottom 0.406: v34.29,43.5 31.75,46.04 21.27,46.04 18.1,49.21 U2.20
A12  (via drill 0.61)
  Top 0.406: v55.56,15.24 57.15,16.83 v57.15,22.54 | v66.04,21.91 IC1.6 | JP4.12 v81.28,52.07 80.96,51.75 80.96,40.64 78.11,37.78 78.11,25.4 v74.61,21.91
  Bottom 0.406: IC26.2 66.04,52.07 67.31,50.8 73.66,50.8 74.93,52.07 v81.28,52.07 IC4.2 | v55.56,15.24 49.85,15.24 48.58,16.51 IC17.9 | v57.15,22.54 57.47,22.86 62.23,22.86 63.5,21.59 65.72,21.59 v66.04,21.91 v74.61,21.91
A12'  (via drill 0.61)
  Top 0.406: v42.86,21.91 42.86,19.05 IC17.11 | v23.18,22.86 21.59,24.45 21.59,35.24 27.3,40.96 27.3,48.26 30.48,51.44 U2.22
  Bottom 0.406: v42.86,21.91 41.91,22.86 v23.18,22.86
A13  (via drill 0.61)
  Top 0.406: v69.53,6.03 69.85,6.35 69.85,12.06 | 69.85,12.06 69.85,23.5 68.58,24.77 IC1.7 | v45.72,6.03 IC17.7 | JP2.13 83.5,102.87 82.55,101.92 v82.55,53.66 82.23,53.34 82.23,51.44 81.6,50.8 81.6,35.24 81.28,34.92 81.28,20 80.01,18.73 80.01,16.19 74.93,11.11 74.93,6.03 71.75,2.86 69.53,2.86 67.31,5.08 67.31,11.43 67.94,12.06 69.85,12.06
  Bottom 0.406: IC26.26 62.23,54.61 63.5,53.34 69.85,53.34 71.12,54.61 IC4.26 73.34,53.98 82.23,53.98 v82.55,53.66 | v45.72,6.03 46.04,6.35 69.22,6.35 v69.53,6.03
A13'  (via drill 0.61)
  Top 0.406: v40.32,13.65 40.32,11.43 IC17.5 | v10.48,15.24 8.89,16.83 v8.89,47.31
  Bottom 0.406: v40.32,13.65 39.05,14.92 10.79,14.92 v10.48,15.24 | v8.89,47.31 14.92,53.34 28.57,53.34 29.84,54.61 U2.23
A14  (via drill 0.61)
  Top 0.406: 69.85,28.26 70.48,27.62 IC1.8 | v68.58,29.53 69.85,28.26 | IC17.12 40.96,19.05 41.91,20 v41.91,29.53 41.91,44.13 40.32,45.72 40.32,92.08 v40.01,92.39 | 69.85,28.26 v69.85,45.09
  Bottom 0.406: v41.91,29.53 v68.58,29.53 | v69.85,45.09 69.53,45.09 65.72,48.9 IC26.1 | v40.01,92.39 44.45,96.84 82.55,96.84 83.5,97.79 JP4.13
A14'  (via drill 0.61)
  Top 0.406: v19.05,15.88 19.05,55.24 v18.73,55.56
  Bottom 0.406: v19.05,15.88 34.61,15.88 35.24,16.51 IC17.14 | v18.73,55.56 20.32,57.15 U2.24
A15  (via drill 0.61)
  Top 0.406: v40.64,6.35 40.64,6.67 38.42,8.89 IC17.4 | v70.48,5.08 72.71,7.3 72.71,10.79 71.75,11.75 71.75,16.51 72.39,17.14 72.39,18.41 73.66,19.68 IC1.9 73.66,32.07 74.93,33.34 74.93,46.99 80.01,52.07 80.01,83.5 v80.33,83.82 | v83.5,84.45 83.5,86.68 85.09,88.27 85.09,101.92 86.04,102.87 JP2.14
  Bottom 0.406: v40.64,6.35 41.91,5.08 50.16,5.08 50.8,5.71 68.26,5.71 68.9,5.08 v70.48,5.08 | v83.5,84.45 82.87,83.82 v80.33,83.82
A15'  (via drill 0.61)
  Top 0.406: v31.75,13.65 31.75,12.38 32.7,11.43 IC17.2 | v5.08,14.29 3.17,16.19 3.17,46.67 v6.35,49.85
  Bottom 0.406: v31.75,13.65 31.11,14.29 v5.08,14.29 | v6.35,49.85 14.92,58.42 28.57,58.42 29.84,59.69 U2.25
D0  (via drill 0.61)
  Top 0.406: v52.07,78.74 v54.93,75.88 | JP4.14 86.04,97.79 85.72,97.47 85.72,75.88 86.36,75.25 IC4.11
  Bottom 0.406: IC8.6 IC4.11 74.93,74.93 73.66,76.2 67.31,76.2 66.04,74.93 IC26.11 63.82,75.56 55.24,75.56 v54.93,75.88 | v52.07,78.74 48.58,78.74 47.94,78.11 44.77,78.11 44.45,77.79 IC7.9
D0'
  Bottom 0.406: U2.33 IC7.11
D1  (via drill 0.61)
  Top 0.406: v57.15,76.52 v59.05,78.42 | JP2.15 89.22,102.87 90.17,101.92 90.17,79.06 88.9,77.79 IC4.12
  Bottom 0.406: IC8.5 IC4.12 74.93,77.47 73.66,78.74 67.31,78.74 66.04,77.47 IC26.12 63.82,78.11 59.37,78.11 v59.05,78.42 | v57.15,76.52 56.83,76.83 51.12,76.83 50.48,76.2 45.4,76.2 44.45,75.25 IC7.8
D1'
  Bottom 0.406: U2.32 IC7.12
D2
  Top 0.406: JP4.15 89.22,97.79 89.53,97.47 89.53,80.96 88.9,80.33 IC4.13
  Bottom 0.406: IC8.4 IC4.13 74.93,80.01 73.66,81.28 67.31,81.28 66.04,80.01 IC26.13 63.18,80.01 61.91,81.28 46.67,81.28 44.13,78.74 41.91,78.74 40.32,77.15 40.32,74.93 42.23,73.03 IC7.7
D2'
  Bottom 0.406: U2.31 IC7.13
D3  (via drill 0.61)
  Top 0.406: v47.94,71.12 47.62,71.44 47.62,81.6 48.26,82.23 IC26.15 | JP2.16 91.76,102.87 92.71,101.92 92.71,89.53 92.08,88.9 92.08,83.5 92.71,82.87 IC8.3
  Bottom 0.406: IC26.15 62.23,82.55 63.5,81.28 66.04,81.28 67.31,82.55 IC4.15 73.66,82.55 74.93,81.28 88.9,81.28 90.17,82.55 IC8.3 | v47.94,71.12 45.4,71.12 44.45,70.17 IC7.6
D3'
  Bottom 0.406: U2.30 IC7.14
D4  (via drill 0.61)
  Top 0.406: v46.04,79.06 46.04,69.22 44.45,67.63 IC7.5 | 99.69,81.6 99.69,67.31 100.33,66.67 100.33,36.51 101.28,35.56 IC13.12 | 99.69,81.6 100.33,82.23 IC8.14 | v97.79,92.39 99.69,90.49 99.69,81.6
  Bottom 0.406: v46.04,79.06 46.99,80.01 IC26.16 62.23,80.01 63.5,78.74 66.04,78.74 67.31,80.01 IC4.16 73.66,79.69 74.61,78.74 94.93,78.74 98.74,82.55 IC8.14 | v97.79,92.39 91.55,98.64 JP4.16
D4'
  Bottom 0.406: U2.29 IC7.15
D5  (via drill 0.61)
  Top 0.406: v41.27,75.88 41.27,65.72 41.91,65.09 IC7.4 | v85.41,36.2 83.82,37.78 v83.82,76.2 | JP2.17 94.61,103.19 96.52,101.28 97.16,101.28 103.5,94.93 103.5,80.96 102.87,80.33 IC8.13
  Bottom 0.406: IC8.13 99.69,80.01 95.89,76.2 v83.82,76.2 74.93,76.2 73.66,77.47 IC4.17 67.31,77.47 66.04,76.2 63.5,76.2 62.23,77.47 IC26.17 45.4,77.47 44.13,76.2 41.59,76.2 v41.27,75.88 | v85.41,36.2 107.63,36.2 108.58,35.24 IC13.9
D5'
  Bottom 0.406: U2.28 IC7.16
D6  (via drill 0.61)
  Top 0.406: v105.73,75.88 106.36,75.88 115.57,66.67 115.57,49.85 114.94,49.21 114.94,35.56 114.3,34.92 114.3,33.66 111.76,31.11 111.76,24.77 110.49,23.5 100.01,23.5 97.79,25.72 97.79,27.62 98.74,28.57 99.38,28.57 103.19,32.38 105.41,32.38 105.73,32.07 105.73,28.57 106.36,27.94 IC13.7 | v98.74,77.15 98.74,85.72 94.61,89.85 94.61,97.47 94.3,97.79 JP4.17
  Bottom 0.406: 99.06,76.83 95.89,73.66 74.93,73.66 73.66,74.93 IC4.18 67.31,74.93 66.04,73.66 63.5,73.66 62.23,74.93 IC26.18 47.94,74.93 44.13,71.12 41.91,71.12 41.27,70.48 41.27,63.82 42.23,62.87 IC7.3 | 99.06,76.83 99.69,77.47 IC8.12 104.14,77.47 v105.73,75.88 | 99.06,76.83 v98.74,77.15
D6'
  Bottom 0.406: U2.27 IC7.17
D7  (via drill 0.61)
  Top 0.406: v53.02,60.96 52.7,61.28 52.7,69.53 50.48,71.75 IC26.19 | v105.73,74.61 105.73,73.98 113.03,66.67 113.03,57.78 113.35,57.47 113.35,46.67 111.76,45.09 111.76,32.7 111.12,32.07 111.12,25.08 110.17,24.13 101.28,24.13 99.69,25.72 IC13.4 | JP2.18 97.16,103.19 104.14,96.2 104.14,76.52 102.87,75.25 IC8.11
  Bottom 0.406: IC26.19 62.23,72.39 63.5,71.12 66.04,71.12 67.31,72.39 IC4.19 73.66,72.39 74.93,71.12 95.89,71.12 99.69,74.93 IC8.11 105.41,74.93 v105.73,74.61 | v53.02,60.96 45.4,60.96 44.45,60.01 IC7.2
D7'
  Bottom 0.406: U2.26 IC7.18
GND  (via drill 0.61)
  Top 0.813: JP4.18 CD15.1 | JP1.2 R11.1 | JP3.2 R41.2 133.35,98.42 139.06,92.71 139.06,74.61 136.53,72.07 134.94,72.07 133.35,70.48 C5.2 | VIDEO_OUT.2 R9.2 | RESET.1 C7.2 39.37,96.2 41.27,94.3 41.27,81.6 42.23,80.64 IC7.10 | v68.9,84.14 68.9,55.24 ROMSEL.3 | v96.2,82.23 96.2,71.12 95.25,70.17 IC8.8 | U2.1 15.24,98.42 10.79,102.87 10.79,103.19 PWR.2 | U2.21 33.02,48.9 IC16.15 v33.02,30.8 | v10.16,30.8 IC9.15 9.84,35.56 9.84,44.13 10.16,44.45 10.16,47.62 9.84,47.94 9.84,74.93 12.7,77.79 CD5.1 | v25.72,29.53 25.72,27.94 IC9.8 | v47.94,30.48 47.94,27.94 IC16.8 | v54.61,30.8 CD11.1 | CD3.1 73.66,6.35 71.12,3.81 70.17,3.81 68.26,5.71 68.26,8.89 IC18.7 | IC17.3 35.24,11.43 33.02,13.65 IC17.15 | IC22.8 151.45,50.8 153.03,52.39 153.03,58.74 151.13,60.64 IC2.7 | IC1.10 IC1.11 76.2,37.15 77.47,38.42 CD1.1 | v107.31,29.53 108.9,27.94 IC13.8 | CD13.1 107.95,10.79 105.09,7.94 95.57,7.94 94.3,9.21 94.3,9.53 R4.1 | CD14.1 133.35,15.56 131.76,17.14 131.76,27.3 133.03,28.57 CD2.1 133.35,30.8 127.32,36.83 127.32,44.77 130.81,48.26 CD9.1 | v80.01,30.8 R28.1
  Bottom 0.813: 123.19,106.36 116.52,106.36 115.57,105.41 VIDEO_OUT.2 | R9.2 R6.1 113.35,99.69 111.76,98.11 97.16,98.11 JP4.18 | 133.35,106.36 123.19,106.36 | JP1.2 148.59,105.41 147.32,106.36 133.35,106.36 | IC8.8 95.25,70.17 97.47,70.17 99.69,72.39 IC8.10 | 68.9,84.45 78.11,84.45 80.01,82.55 IC4.14 88.9,82.87 89.85,83.82 96.2,83.82 | 68.9,84.45 67.63,84.45 66.04,82.87 IC26.14 63.5,82.87 61.91,84.45 47.94,84.45 44.13,80.64 IC7.10 | 97.47,83.82 96.2,83.82 | 68.9,84.45 v68.9,84.14 | 96.2,83.82 v96.2,82.23 | CD15.1 94.3,90.81 91.76,88.27 91.76,87 92.39,86.36 95.25,86.36 97.47,84.14 97.47,83.82 | PWR.2 9.84,102.87 5.4,98.42 D14.A 6.99,95.89 6.99,86.04 12.38,80.64 CD5.1 | CD7.1 6.67,30.8 v10.16,30.8 11.43,29.53 v25.72,29.53 26.04,29.53 26.35,29.21 CD12.1 29.53,29.21 31.11,30.8 v33.02,30.8 47.62,30.8 v47.94,30.48 48.26,30.8 v54.61,30.8 54.93,30.48 67.94,30.48 68.26,30.8 v80.01,30.8 85.72,30.8 87.31,29.21 CD4.1 89.53,29.53 v107.31,29.53 113.03,29.53 113.35,29.21 CD2.1 | IC10.15 9.84,16.51 8.89,15.56 4.76,15.56 3.81,14.61 3.81,13.34 4.45,12.7 CD6.1 25.72,12.7 | IC17.8 48.26,12.38 | 25.72,12.7 25.72,11.43 IC10.8 | 25.72,12.7 CD8.1 28.57,12.38 34.29,12.38 | 34.29,12.38 35.24,11.43 IC17.3 | 34.29,12.38 48.26,12.38 | C4.2 C5.2 133.99,66.99 134.62,66.36 147.96,66.36 150.81,63.5 IC2.7 | CD9.1 131.44,52.39 149.22,52.39 150.81,50.8 IC22.8 | R28.1 IC1.11 | R4.1 IC19.7 | IC20.8 128.91,9.21 130.81,7.3 149.22,7.3 150.81,8.89 IC21.7 | IC21.7 153.99,13.02 153.99,22.86 151.45,25.4 IC14.7 | IC21.7 150.81,11.43 149.22,13.02 133.99,13.02 CD14.1 133.03,13.02 108.58,13.02 CD13.1 107.63,13.02 74.3,13.02 CD3.1 73.34,13.02 51.44,13.02 CD10.1 48.58,12.7 48.26,12.38
  Bottom 0.813: 123.19,106.36 AUDIO_OUT.2 | JP3.2 133.35,106.36 | IC8.15 100.33,83.82 97.47,83.82
HBORDER  (via drill 0.61)
  Top 0.406: IC20.15 v113.03,20.64 D8.C
  Bottom 0.406: v113.03,20.64 146.05,20.64 147.96,18.73 IC21.9
HSYNC
  Top 0.406: IC20.11 D10.C
I/O  (via drill 0.61)
  Top 0.406: v67.94,38.73 67.94,37.15 66.36,35.56 IC1.15 | v84.77,39.37 v84.77,86.36 | v56.2,95.89 55.88,96.2 JP4.2
  Bottom 0.406: v67.94,38.73 68.58,39.37 v84.77,39.37 | v84.77,86.36 75.25,95.89 v56.2,95.89
IRQ  (via drill 0.61)
  Top 0.406: v58.42,94.93 JP4.3 | R33.2 15.24,90.17 U2.4
  Bottom 0.406: v58.42,94.93 54.93,91.44 17.78,91.44 U2.4
N$1
  Top 0.406: T3.1 R45.1
N$2
  Bottom 0.406: IC3.16 D15.A
N$3
  Bottom 0.406: ROMSEL.2 IC4.27
N$4
  Top 0.406: R45.2 VIDEO_OUT.1
N$5
  Top 0.406: IC14.8 D1.C
N$7
  Top 0.406: IC20.7 126.36,9.21 127.32,8.26 136.21,8.26 137.16,9.21 137.16,11.11 142.24,16.19 142.24,18.73 147.32,23.81 147.32,27.62 148.59,28.89 IC14.9
N$8
  Top 0.406: D3.A 118.11,28.57 116.84,27.3 116.84,26.04 116.2,25.4 116.2,18.73 IC20.14
  Bottom 0.406: D3.A 118.43,34.92 119.38,35.88 124.46,35.88 125.41,34.92 D2.A | IC20.14 115.25,16.51 114.62,15.88 106.36,15.88 104.78,17.46 R2.2
N$9  (via drill 0.61)
  Top 0.406: IC18.2 56.2,11.43 58.42,13.65 IC18.12 v58.42,21.91 | v50.8,23.81 D4.A | IC19.12 81.28,13.65 79.06,11.43 IC19.2 78.74,2.22 79.06,1.91 145.1,1.91 152.72,9.53 152.72,39.37 151.13,40.96 D1.A
  Bottom 0.406: v50.8,23.81 53.02,21.59 58.1,21.59 v58.42,21.91 | IC19.2 78.11,11.11 77.15,12.06 75.56,12.06 74.3,10.79 72.07,10.79 71.75,10.48 R3.2 70.8,10.79 69.53,12.06 56.83,12.06 56.2,11.43 IC18.2
N$14
  Top 0.406: C2.1 JP1.3
N$15
  Top 0.406: IC21.2 138.11,8.89 135.57,6.35 85.41,6.35 85.09,6.67 85.09,7.94 86.04,8.89 IC19.5 | R4.2 93.98,14.29 96.52,11.75 D5.C
  Bottom 0.406: IC19.5 86.68,11.43 87.31,12.06 94.93,12.06 96.2,10.79 D5.C
N$17  (via drill 0.61)
  Top 0.406: v77.79,4.76 75.25,2.22 69.22,2.22 64.77,6.67 64.77,19.05 64.14,19.68 63.18,19.68 62.23,18.73 62.23,16.83 61.59,16.19 61.59,11.75 61.28,11.43 IC18.4 | v82.23,7.3 83.82,5.71 136.84,5.71 139.7,8.57 139.7,11.11 141.92,13.34 v141.92,14.29
  Bottom 0.406: v77.79,4.76 80.33,7.3 v82.23,7.3 | v141.92,14.29 140.97,15.24 IC21.12
N$18
  Top 0.406: R22.1 101.6,18.41 102.55,19.37 108.27,19.37 109.22,18.41 109.22,14.92 112.71,11.43 IC20.2
  Bottom 0.406: D5.A D13.A R22.1
N$20  (via drill 0.61)
  Top 0.406: IC14.5 145.73,27.94 144.78,28.89 144.78,35.24 146.05,36.51 IC22.6 146.05,54.93 147.32,56.2 147.32,63.18 v145.41,65.09
  Bottom 0.406: v145.41,65.09 130.81,65.09 123.83,72.07 123.83,81.28 120.97,84.14 114.3,84.14 113.67,84.77 C1.1
N$21
  Top 0.406: R6.2 C1.2
  Bottom 0.406: IC8.1 95.25,87.95 96.2,88.9 104.78,88.9 108.58,92.71 R5.1 R6.2
N$22
  Top 0.406: IC21.4 143.83,11.43 146.05,13.65 IC21.10 | IC21.13 138.43,13.65 136.21,11.43 IC21.1 135.25,10.79 133.35,10.79 130.81,13.34 130.81,32.07 126.36,36.51 126.36,69.53 127,70.17 127,94.3 123.19,98.11 R26.2
  Bottom 0.406: IC21.4 143.19,8.89 142.56,8.26 136.84,8.26 136.21,8.89 IC21.1
N$23
  Bottom 0.406: IC8.9 102.87,70.17 114.94,82.23 D6.C
N$24
  Top 0.406: R7.1 118.43,74.61 118.43,47.62 115.57,44.77 D7.A
  Bottom 0.406: R7.1 D6.A | D8.A D7.A
N$26
  Top 0.406: D9.A R8.1 120.33,75.56 118.11,77.79 R7.2 T3.2 115.57,88.9 R9.1
  Bottom 0.406: D9.A D10.A
N$27
  Top 0.406: R14.2 R13.2 151.13,84.14 148.59,86.68 D12.C
  Bottom 0.406: D12.C D11.A | R15.1 R14.2
N$28
  Top 0.406: R10.2 144.15,90.49 145.73,92.08 C2.2
  Bottom 0.406: C2.2 R11.2
N$29
  Top 0.406: IC22.13 141.29,58.42 142.24,59.37 142.24,70.8 141.6,71.44 141.6,81.28 142.88,82.55 R10.1
  Bottom 0.406: R29.2 126.36,75.25 131.76,80.64 139.7,80.64 141.6,82.55 R10.1
N$30
  Top 0.406: R29.1 T1.2
N$31
  Top 0.406: T1.1 R12.1
N$32
  Top 0.406: R12.2 AUDIO_OUT.1
N$33
  Top 0.406: R18.2 JP1.5
N$34
  Top 0.406: R13.1 C3.1
N$37
  Bottom 0.406: IC3.15 D16.A
N$38
  Top 0.406: JP1.1 C3.2
N$39
  Bottom 0.406: R16.1 R15.2 IC2.8
N$40
  Top 0.406: R16.2 146.69,80.33 148.27,81.92 D12.A
N$41
  Top 0.406: R14.1 150.5,72.71 149.22,73.98 143.51,73.98 R17.2
  Bottom 0.406: R17.2 IC2.12
N$42
  Top 0.406: R17.1 144.15,80.33 145.73,81.92 D11.C
N$43  (via drill 0.61)
  Top 0.406: v104.78,31.43 104.78,28.26 104.46,27.94 IC13.6 | v153.67,31.75 153.99,32.07 153.99,62.55 148.59,67.94 IC2.9
  Bottom 0.406: v104.78,31.43 105.09,31.75 v153.67,31.75
N$44
  Top 0.406: R42.1 JP3.1
N$46  (via drill 0.61)
  Top 0.406: v100.97,32.07 96.84,27.94 IC13.3 | v144.78,37.47 145.41,38.1 145.41,47.94 144.78,48.58 144.78,58.1 146.05,59.37 IC2.5
  Bottom 0.406: v100.97,32.07 101.28,32.38 128.27,32.38 132.08,36.2 143.51,36.2 v144.78,37.47
N$47
  Top 0.406: C4.1 132.72,60.33 139.38,60.33 140.34,61.28 IC2.3
N$48
  Top 0.406: R19.1 143.19,92.08 140.02,88.9 140.02,71.12 139.7,70.8 139.7,68.9 138.43,67.63 IC2.2
  Bottom 0.406: C5.1 IC2.1 IC2.2
N$49
  Top 0.406: R19.2 JP1.4
N$50
  Top 0.406: IC14.13 138.43,40.01 Q1.1
  Bottom 0.406: R20.2 133.99,38.42 136.21,40.64 Q1.1
N$51
  Top 0.406: IC14.4 143.19,27.94 142.24,28.89 142.24,38.42 140.65,40.01 140.65,47.62 139.7,48.58 139.7,53.98 138.43,55.24 IC22.14
N$52
  Top 0.406: IC14.11 143.83,35.56 143.83,38.1 144.78,39.05 144.78,42.55 143.51,43.81 C6.2
  Bottom 0.406: C6.2 R21.1
N$53
  Top 0.406: IC14.12 140.65,35.56 140.02,36.2 140.02,42.23 138.43,43.81 C6.1
  Bottom 0.406: C6.1 R20.1
N$54
  Bottom 0.406: R23.2 12.38,90.81 10.79,92.39 10.79,95.25 12.06,96.52 26.04,96.52 29.84,92.71 U2.38
N$55
  Bottom 0.406: IC3.14 D17.A
N$56
  Bottom 0.406: IC3.13 D18.A
N$62
  Top 0.406: IC18.10 63.18,16.51 62.23,15.56 62.23,9.21 60.64,7.62 56.83,3.81 26.67,3.81 21.59,8.89 21.59,23.5 20.32,24.77 IC9.6
N$64
  Bottom 0.406: IC3.12 D19.A
N$70
  Top 0.406: IC13.11 103.82,35.56 102.87,36.51 102.87,38.73 104.14,40.01 R36.2
  Bottom 0.406: R36.2 IC3.5
N$71
  Top 0.406: IC13.14 96.2,35.56 95.25,36.51 95.25,38.73 96.52,40.01 R38.2
  Bottom 0.406: R38.2 IC3.2
N$72
  Top 0.406: IC13.10 107,35.56 108.27,36.83 108.27,42.23 106.68,43.81 R37.2
  Bottom 0.406: R37.2 IC3.6
N$73
  Top 0.406: IC3.4 101.6,48.9 102.87,50.16 107,50.16 107.95,49.21 107.95,47.31 110.81,44.45 110.81,32.7 110.49,32.38 110.49,25.4 109.86,24.77 103.19,24.77 102.23,25.72 IC13.5
  Bottom 0.406: IC3.4 R35.2
N$74  (via drill 0.61)
  Top 0.406: IC13.2 93.66,27.94 92.71,28.89 92.71,42.55 93.98,43.81 R34.2 | v128.59,58.42 128.59,69.22 130.81,71.44 R43.1
  Bottom 0.406: R34.2 IC3.1 94.3,49.53 95.89,51.12 120.97,51.12 128.27,58.42 v128.59,58.42
N$75
  Top 0.406: IC13.13 98.74,35.56 97.79,36.51 97.79,38.73 99.06,40.01 R39.2
  Bottom 0.406: R39.2 IC3.3
N$76
  Bottom 0.406: IC22.2 136.21,50.8 136.84,51.44 147,51.44 147.96,50.48 IC22.7
N$77
  Bottom 0.406: IC22.3 IC22.4
N$78
  Bottom 0.406: R40.1 R44.1 150.81,74.93 152.72,73.03 152.72,61.59 150.81,59.69 147.64,59.69 146.05,58.1 IC22.11
N$79
  Top 0.406: R40.2 T2.2
N$80
  Top 0.406: T2.3 R41.1
  Bottom 0.406: R41.1 R42.2
N$81
  Top 0.406: R43.2 JP3.3
N$82
  Bottom 0.406: IC3.11 D20.A
N$83
  Bottom 0.406: IC3.10 D21.A
N$84
  Bottom 0.406: IC3.9 D22.A
N$85
  Bottom 0.406: D23.A 117.79,59.37 129.22,59.37 129.54,59.05 129.54,57.78 129.22,57.47 128.59,57.47 120.33,49.21 112.39,49.21 IC3.8
N$86  (via drill 0.61)
  Top 0.406: v114.3,50.16 D24.A
  Bottom 0.406: v114.3,50.16 110.17,50.16 109.54,49.53 IC3.7
NMI
  Bottom 0.406: U2.6 R31.2 9.53,88.27 9.53,97.47 19.05,107 58.42,107 60.33,105.09 JP2.4
PHI0  (via drill 0.61)
  Top 0.406: IC21.3 141.29,11.43 143.51,13.65 IC21.11 148.59,22.86 IC14.6 | v42.86,83.82 46.99,79.69 46.99,25.72 48.26,24.45 48.26,20 49.53,18.73 49.53,17.14 v50.48,16.19
  Bottom 0.406: IC14.1 136.21,25.4 136.84,24.77 147.64,24.77 148.27,25.4 IC14.6 | IC21.11 142.88,18.73 141.92,19.68 132.4,19.68 127.95,15.24 57.47,15.24 55.88,16.83 IC18.13 55.88,17.14 54.61,15.88 50.8,15.88 v50.48,16.19 | v42.86,83.82 39.37,83.82 33.34,89.85 U2.37
PHI0'  (via drill 0.61)
  Top 0.406: IC17.1 30.8,11.43 30.8,15.88 31.75,16.83 31.75,22.23 30.48,23.5 IC16.1 | IC10.1 7.3,11.43 6.67,12.06 6.67,16.51 6.35,16.83 6.35,18.73 7.62,20 IC9.1 | v64.77,94.93 64.77,101.92 65.72,102.87 JP2.6
  Bottom 0.406: IC14.2 137.79,27.62 136.84,28.57 135.25,28.57 133.99,27.3 127.95,27.3 127,28.26 109.86,28.26 109.54,28.57 90.81,28.57 89.53,27.3 84.14,27.3 82.87,28.57 54.29,28.57 53.66,27.94 IC1.1 52.7,27.62 51.75,28.57 31.43,28.57 30.8,27.94 IC16.1 29.84,27.3 26.99,27.3 25.72,28.57 9.21,28.57 8.57,27.94 7.94,27.94 IC9.1 | IC10.1 4.45,10.16 2.54,12.06 2.54,55.56 13.02,66.04 18.1,66.04 23.18,60.96 33.34,60.96 34.29,60.01 IC7.19 35.88,59.69 37.47,61.28 37.47,76.83 51.44,90.81 60.64,90.81 v64.77,94.93
PHI2
  Top 0.406: IC1.2 56.2,27.94 57.15,28.89 57.15,37.47 55.56,39.05 55.56,44.13 56.2,44.77 56.2,57.15 55.88,57.47 55.88,94.61 53.34,97.16 JP4.1
  Bottom 0.406: U2.39 33.34,95.57 33.66,95.89 42.55,95.89 45.72,99.06 JP4.1
R/W  (via drill 0.61)
  Top 0.406: v71.75,40.32 71.75,37.15 73.34,35.56 IC1.12 | v61.28,40.64 v61.28,50.8 60.96,51.12 60.96,61.91 62.55,63.5 62.55,83.5 63.18,84.14 63.18,97.79 JP4.5
  Bottom 0.406: v71.75,40.32 71.44,40.64 v61.28,40.64 | v61.28,50.8 60.01,52.07 IC26.27 45.72,52.07 43.18,54.61 IC7.1
R/WB  (via drill 0.61)
  Top 0.406: v52.07,47.31 52.07,25.72 53.02,24.77 53.02,23.81 53.98,22.86 55.56,22.86 58.1,25.4 IC1.3 | v38.42,47.62 37.78,48.26 37.78,80.01 35.56,82.23 33.34,82.23 U2.34
  Bottom 0.406: v52.07,47.31 51.75,47.62 v38.42,47.62
RDY
  Bottom 0.406: JP2.3 57.78,105.09 56.52,106.36 19.37,106.36 10.16,97.16 10.16,90.81 12.06,88.9 13.34,88.9 14.29,89.85 14.29,91.12 R32.2 15.24,95.25 U2.2
RST
  Top 0.406: R25.1 D14.C | C7.1 RESET.2
  Bottom 0.406: C7.1 U2.40 29.84,97.79 28.26,99.38 14.61,99.38 13.34,98.11 D14.C | JP4.4 60.33,100.01 58.42,101.92 38.1,101.92 37.15,102.87 RESET.2
SYNC
  Top 0.406: JP2.5 62.87,105.09 60.64,107.31 35.56,107.31 18.73,90.49 18.73,84.14 17.78,83.19 U2.7
  Bottom 0.406: R24.2 U2.7
VBORDER
  Top 0.406: IC20.1 111.12,9.21 112.08,8.26 113.67,8.26 114.3,8.89 114.3,18.73 115.57,20 D7.C
  Bottom 0.406: IC21.6 147.96,11.11 147,12.06 135.25,12.06 133.99,10.79 130.49,10.79 129.22,12.06 111.44,12.06 110.81,11.43 IC20.1
VCC  (via drill 0.61)
  Top 0.813: CD13.2 107.63,17.14 104.14,13.65 R2.1 | IC21.14 135.57,19.05 133.99,20.64 133.99,27.3 135.89,29.21 IC14.14 136.21,35.56 136.21,47.31 137.16,48.26 137.16,58.42 136.21,59.37 134.94,59.37 133.35,57.78 IC22.16 | v113.03,14.29 110.81,16.51 IC20.16 | IC2.4 143.51,65.41 146.05,67.94 IC2.10 | T2.1 137.16,86.36 R44.2 | CD15.2 IC8.16 | R8.2 T3.3 120.65,87.95 123.19,90.49 R26.1 121.28,94.61 116.52,94.61 111.12,100.01 R5.2 | CD9.2 127.95,57.15 127.32,57.78 127.32,69.22 128.27,70.17 T1.3 | v49.85,36.83 49.53,37.15 CD11.2 IC26.28 | v35.56,53.66 IC7.20 | IC4.28 CD1.2 | v82.55,49.21 R27.2 | CD4.2 88.9,46.35 87.63,47.62 IC4.1 | v91.76,38.1 91.44,37.78 IC13.16 | PWR.1 7.3,102.87 6.99,102.55 6.99,96.2 5.71,94.93 R25.2 R32.1 R23.1 R33.1 R31.1 R24.1 5.08,80.33 6.99,80.33 CD5.2 IC9.16 7.62,29.21 5.4,26.99 5.4,18.41 CD6.2 | JP2.1 51.86,106.36 36.2,106.36 19.68,89.85 19.68,81.92 18.1,80.33 U2.8 | 28.57,20.64 30.16,19.05 IC17.16 | 28.57,20.64 28.57,27.3 30.48,29.21 IC16.16 30.48,46.67 v31.75,47.94 | v41.91,13.65 43.18,12.38 IC17.6 | v50.8,20.64 CD10.2 | v71.12,20.64 R3.1 | v38.1,20.64 IC17.13 | v28.26,20.64 28.57,20.64 | v129.22,38.1 132.72,34.61 CD2.2
  Bottom 0.813: IC20.16 CD13.2 | R2.1 R22.2 | IC21.14 CD14.2 131.76,17.78 128.27,14.29 v113.03,14.29 | CD2.2 IC14.14 | CD9.2 IC22.16 133.67,58.42 135.25,60.01 142.24,60.01 143.19,60.96 IC2.4 | IC2.10 145.73,68.58 144.78,67.63 137.16,67.63 135.89,68.9 IC2.14 | R18.1 T2.1 134.3,86.04 128.59,86.04 T1.3 126.36,84.45 124.14,84.45 122.24,86.36 T3.3 | CD15.2 102.23,91.12 105.73,94.61 119.7,94.61 121.6,92.71 R26.1 | v49.85,36.83 51.75,36.83 53.02,35.56 IC1.20 | 37.31,51.91 39.69,49.53 IC26.28 | 37.31,51.91 v35.56,53.66 | CD4.2 IC13.16 | 82.55,49.53 IC4.1 | 82.55,49.53 IC4.28 ROMSEL.1 67.31,49.85 66.99,49.85 66.04,50.8 63.5,50.8 62.23,49.53 60.01,49.53 55.24,44.77 53.98,44.77 53.02,45.72 50.48,45.72 50.16,46.04 CD11.2 | 82.55,49.53 v82.55,49.21 | v91.76,38.1 R34.1 R38.1 R39.1 R35.1 R36.1 R37.1 v129.22,38.1 | CD5.2 8.26,79.69 10.16,77.79 12.7,77.79 14.61,79.69 14.92,79.69 U2.8 | IC17.16 CD8.2 | IC16.16 CD12.2 | IC19.14 CD3.2 R3.1 | CD10.2 IC18.14 | CD6.2 IC10.16 7.94,19.05 9.53,20.64 v28.26,20.64 v38.1,20.64 v50.8,20.64 v71.12,20.64 | IC9.16 CD7.2 | v31.75,47.94 33.34,47.94 37.15,51.75 37.31,51.91 | IC17.13 38.1,17.46 v41.91,13.65
VSYNC
  Top 0.406: IC20.5 120.33,11.43 119.38,12.38 119.38,18.73 120.65,20 D9.C

## Text on the board
Top: ORAO 2007
Bottom: ORAO 2007
tPlace: Keyboard | rev2-1, 2024